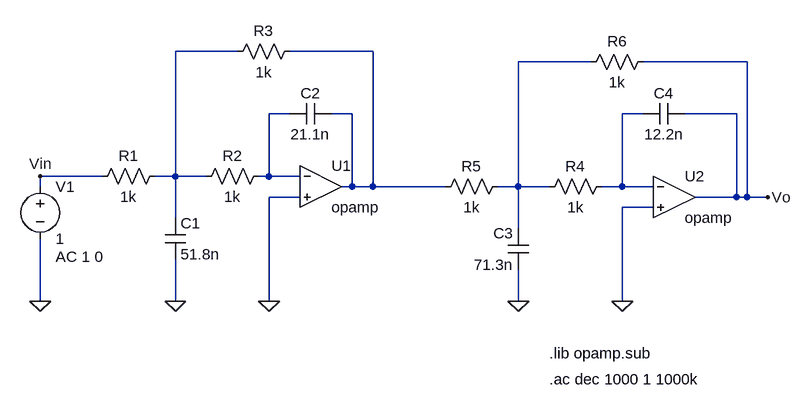
[diagram p0: schematic Ex_7.asc]
Ex_7.asc, the LTspice schematic file:
Version 4
SHEET 1 880 680
WIRE -32 -64 -128 -64
WIRE 176 -64 48 -64
WIRE 512 -48 400 -48
WIRE 752 -48 592 -48
WIRE 48 32 16 32
WIRE 144 32 112 32
WIRE 592 32 560 32
WIRE 736 32 656 32
WIRE -240 128 -336 128
WIRE -128 128 -128 -64
WIRE -128 128 -160 128
WIRE -80 128 -128 128
WIRE 16 128 16 32
WIRE 16 128 0 128
WIRE 64 128 16 128
WIRE -336 144 -336 128
WIRE 144 144 144 32
WIRE 144 144 128 144
WIRE 176 144 176 -64
WIRE 176 144 144 144
WIRE 288 144 176 144
WIRE 400 144 400 -48
WIRE 400 144 368 144
WIRE 448 144 400 144
WIRE 560 144 560 32
WIRE 560 144 528 144
WIRE 608 144 560 144
WIRE 64 160 16 160
WIRE 736 160 736 32
WIRE 736 160 672 160
WIRE 752 160 752 -48
WIRE 752 160 736 160
WIRE 784 160 752 160
WIRE 608 176 560 176
WIRE -128 192 -128 128
WIRE 400 208 400 144
WIRE -336 320 -336 224
WIRE -128 320 -128 256
WIRE 16 320 16 160
WIRE 400 320 400 272
WIRE 560 320 560 176
FLAG -336 320 0
FLAG -128 320 0
FLAG 16 320 0
FLAG 400 320 0
FLAG 560 320 0
FLAG -336 128 Vin
FLAG 784 160 Vo
SYMBOL OpAmps\\opamp 96 80 R0
SYMATTR InstName U1
SYMBOL OpAmps\\opamp 640 96 R0
SYMATTR InstName U2
SYMBOL voltage -336 128 R0
WINDOW 123 24 124 Left 2
WINDOW 39 0 0 Left 0
SYMATTR InstName V1
SYMATTR Value 1
SYMATTR Value2 AC 1 0
SYMBOL res -144 112 R90
WINDOW 0 0 56 VBottom 2
WINDOW 3 32 56 VTop 2
SYMATTR InstName R1
SYMATTR Value 1k
SYMBOL res 16 112 R90
WINDOW 0 0 56 VBottom 2
WINDOW 3 32 56 VTop 2
SYMATTR InstName R2
SYMATTR Value 1k
SYMBOL res 64 -80 R90
WINDOW 0 0 56 VBottom 2
WINDOW 3 32 56 VTop 2
SYMATTR InstName R3
SYMATTR Value 1k
SYMBOL res 544 128 R90
WINDOW 0 0 56 VBottom 2
WINDOW 3 32 56 VTop 2
SYMATTR InstName R4
SYMATTR Value 1k
SYMBOL res 384 128 R90
WINDOW 0 0 56 VBottom 2
WINDOW 3 32 56 VTop 2
SYMATTR InstName R5
SYMATTR Value 1k
SYMBOL res 608 -64 R90
WINDOW 0 0 56 VBottom 2
WINDOW 3 32 56 VTop 2
SYMATTR InstName R6
SYMATTR Value 1k
SYMBOL cap -144 192 R0
SYMATTR InstName C1
SYMATTR Value 51.8n
SYMBOL cap 112 16 R90
WINDOW 0 0 32 VBottom 2
WINDOW 3 32 32 VTop 2
SYMATTR InstName C2
SYMATTR Value 21.1n
SYMBOL cap 416 272 R180
WINDOW 0 24 56 Left 2
WINDOW 3 24 8 Left 2
SYMATTR InstName C3
SYMATTR Value 71.3n
SYMBOL cap 592 48 R270
WINDOW 0 32 32 VTop 2
WINDOW 3 0 32 VBottom 2
SYMATTR InstName C4
SYMATTR Value 12.2n
TEXT 448 400 Left 2 !.lib opamp.sub
TEXT 448 440 Left 2 !.ac dec 1000 1 1000k

The netlist it stands for:
* Ex_7.asc
XU1 N004 0 N002 opamp Aol=100K GBW=10Meg  ; pins invin noninvin out
XU2 N005 0 Vo opamp Aol=100K GBW=10Meg  ; pins invin noninvin out
V1 Vin 0 1 AC 1 0
R1 N001 Vin 1k
R2 N004 N001 1k
R3 N002 N001 1k
R4 N005 N003 1k
R5 N003 N002 1k
R6 Vo N003 1k
C1 N001 0 51.8n
C2 N002 N004 21.1n
C3 0 N003 71.3n
C4 N005 Vo 12.2n
.lib opamp.sub
.ac dec 1000 1 1000k
.backanno
.end